# Altium schematic sheet Tiny Mic.SchDoc
size B; SheetNumber: 1; SheetTotal: 1; SPICEModelCacheUAEHSMRL: <root> / <DocumentId>UAEHSMRL</DocumentId> / </root>
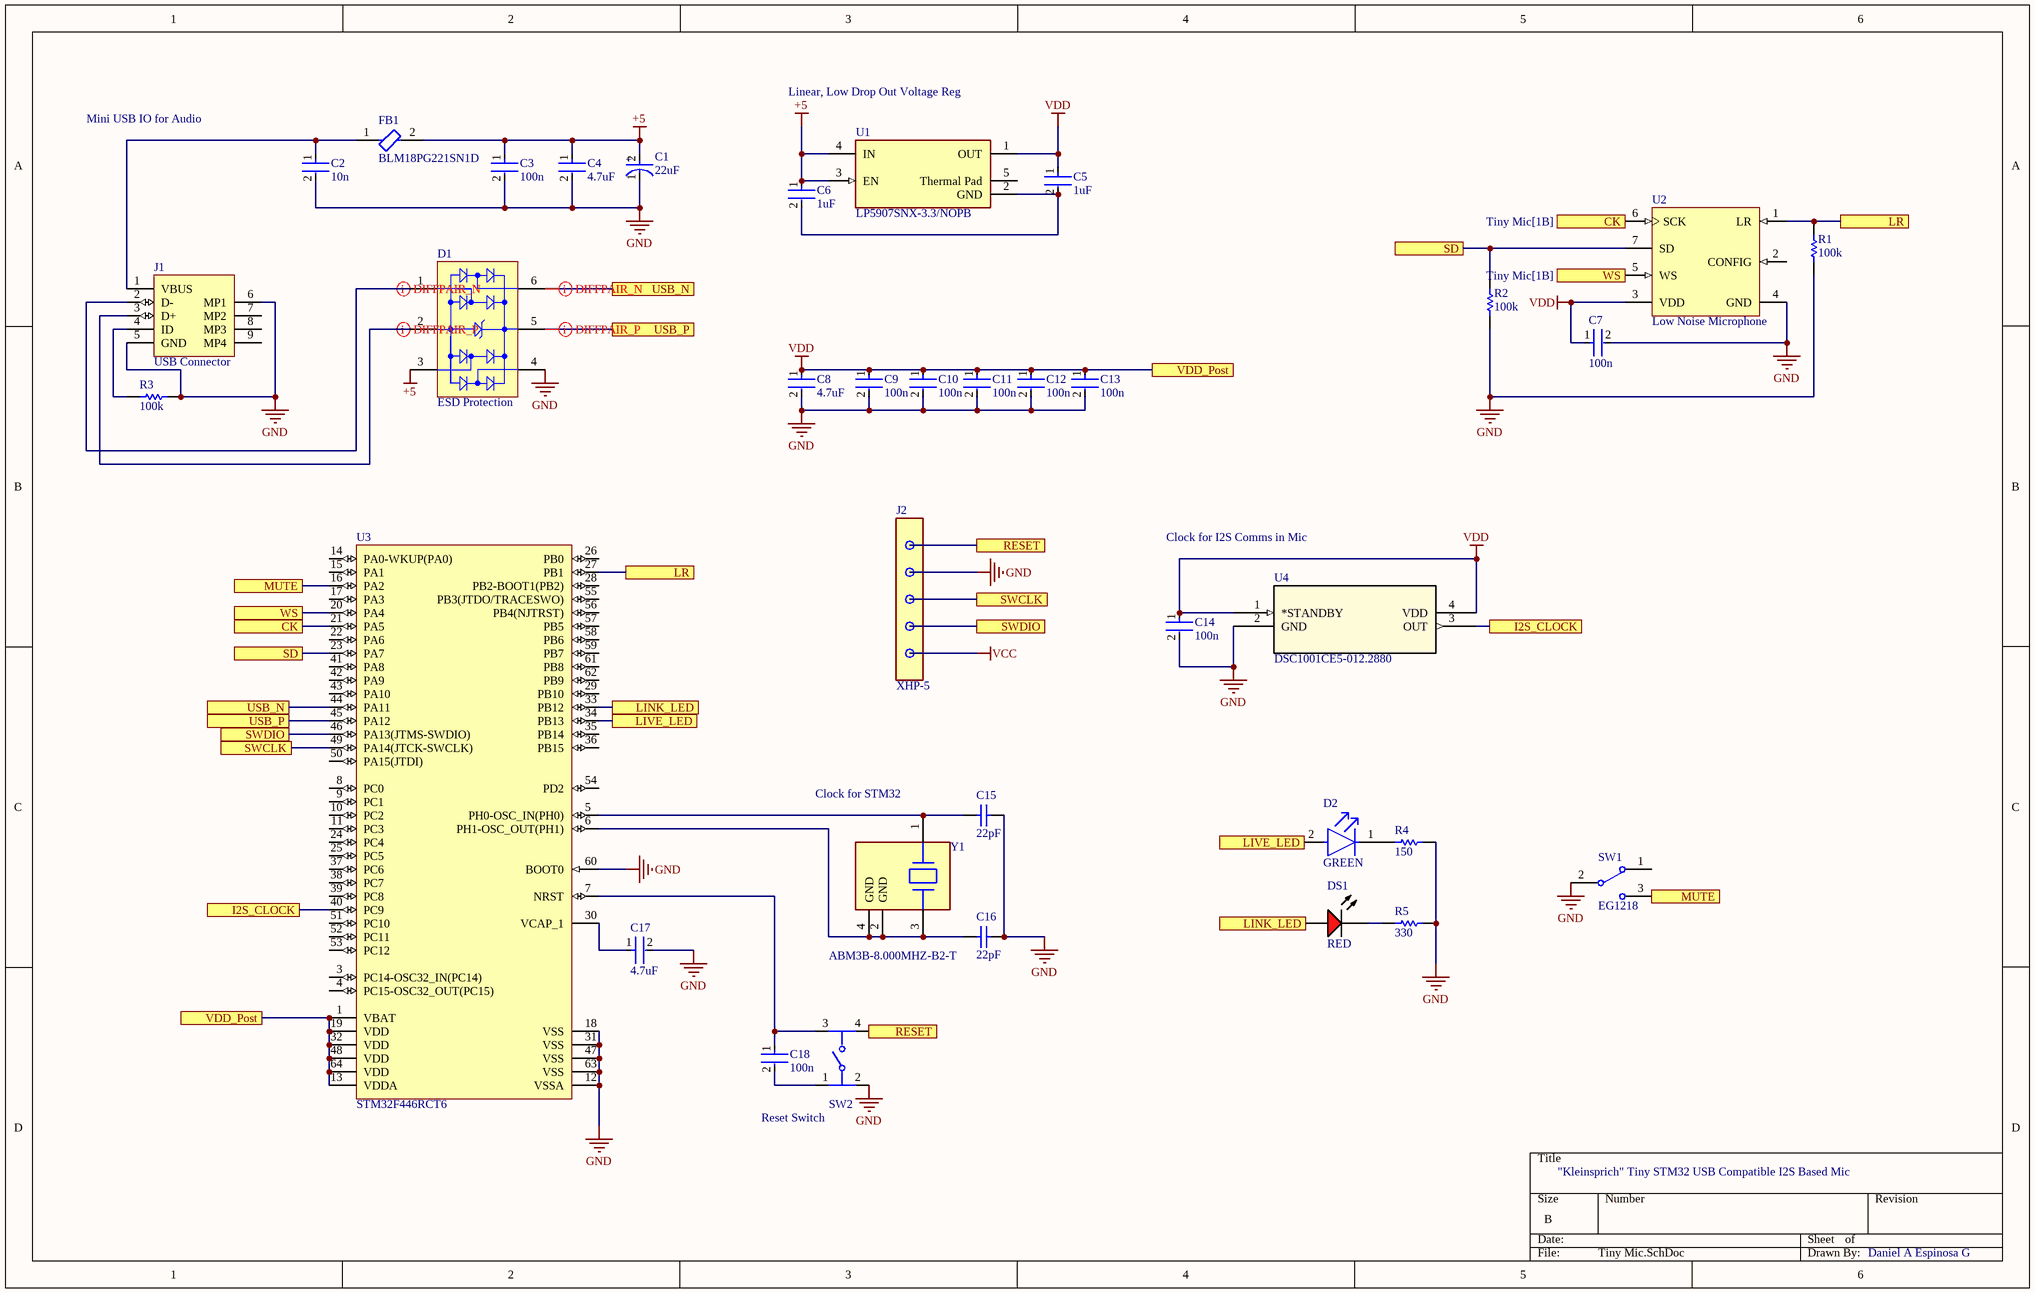
[diagram p0: Tiny Mic.SchDoc]

## Parts
C1  22uF  [FP-TAJC-MFG]
C2  10n  [FP-C0805C-DN-MFG]
C3  100n  [FP-C1206C-EB-MFG]
C4  4.7uF  [FP-C1005-050-0_15-MFG]
C5  1uF  [FP-GRM15-0_1-MFG]
C6  1uF  [FP-GRM15-0_1-MFG]
C7  100n  [FP-C1206C-EB-MFG]
C8  4.7uF  [FP-C1005-050-0_15-MFG]
C9  100n  [FP-C1206C-EB-MFG]
C10  100n  [FP-C1206C-EB-MFG]
C11  100n  [FP-C1206C-EB-MFG]
C12  100n  [FP-C1206C-EB-MFG]
C13  100n  [FP-C1206C-EB-MFG]
C14  100n  [FP-C1206C-EB-MFG]
C15  22pF  [CAPC1005X55X25NL05T10]
C16  22pF  [CAPC1005X55X25NL05T10]
C17  4.7uF  [FP-C1005-050-0_15-MFG]
C18  100n  [FP-C1206C-EB-MFG]
D1  ESD Protection  [STM-SOT23-6L_V]
D2  GREEN  [FP-LTST-C190GKT-MFG]
DS1  RED  [AVAG-HSMX-C150_V]
FB1  BLM18PG221SN1D  [FP-BLM18-0_15-t0_8-IPC_B]
J1  USB Connector  [MOLX-67503-1020_V]
J2  XHP-5  [FP-XHP-5-MFG]
R1  100k  [RESC1609X55X30ML10T20]
R2  100k  [RESC1609X55X30ML10T20]
R3  100k  [RESC1609X55X30ML10T20]
R4  150  [RESC1608X55X25ML10T15]
R5  330  [RESC1608X55X30LL15T15]
SW1  EG1218  [ESWI-EG1218_V]
SW2  (no value)  [FP-FSM2JSMAA-MFG]
U1  LP5907SNX-3.3/NOPB  [FP-DQN0004A-MFG]
U2  Low Noise Microphone  [INSE-ICS-43432_V]
U3  STM32F446RCT6  [STM-LQFP64_L]
U4  DSC1001CE5-012.2880  [CDFN4_3P2X2P5_MCH]
Y1  ABM3B-8.000MHZ-B2-T  [FP-ABM3B-MFG]

## Ports
CK (see Tiny Mic[1B]), CK (see Tiny Mic[5A]), I2S_CLOCK (see Tiny Mic[1C]), I2S_CLOCK (see Tiny Mic[5B]), LINK_LED (see Tiny Mic[2C]), LINK_LED (see Tiny Mic[4C]), LIVE_LED (see Tiny Mic[2C]), LIVE_LED (see Tiny Mic[4C]), LR (see Tiny Mic[2B]), LR (see Tiny Mic[6A]), MUTE (see Tiny Mic[1B]), MUTE (see Tiny Mic[5C]), RESET (see Tiny Mic[3B]), RESET (see Tiny Mic[3D]), SD (see Tiny Mic[1C]), SD (see Tiny Mic[5A]), SWCLK (see Tiny Mic[1C]), SWCLK (see Tiny Mic[3B]), SWDIO (see Tiny Mic[1C]), SWDIO (see Tiny Mic[3B]), USB_N (see Tiny Mic[1C]), USB_N (see Tiny Mic[2A]), USB_P (see Tiny Mic[1C]), USB_P (see Tiny Mic[2B]), VDD_Post (see Tiny Mic[1D]), VDD_Post (see Tiny Mic[4B]), WS (see Tiny Mic[1B]), WS (see Tiny Mic[5A])

## Nets
+5: C1.2(A) C3.1 C4.1 C6.1 D1.3(I/O_2) FB1.2 U1.3(EN) U1.4(IN)
GND: C1.1(C) C2.2 C3.2 C4.2 C7.2 C8.2 C9.2 C10.2 C11.2 C12.2 C13.2 C14.2 C15.2 C16.2 C17.2 D1.4(I/O_3) J1.5(GND) J1.6(MP1) R1.1 R2.1 R3.2 R4.2 R5.2 SW1.2(COM) SW2.2 U2.4(GND) U3.12(VSSA) U3.18(VSS) U3.31(VSS) U3.47(VSS) U3.60(BOOT0) U3.63(VSS) U4.2(GND)
VDD: C5.1 C7.1 C8.1 C9.1 C10.1 C11.1 C12.1 C13.1 C14.1 U1.1(OUT) U2.3(VDD) U3.1(VBAT) U3.13(VDDA) U3.19(VDD) U3.32(VDD) U3.48(VDD) U3.64(VDD) U4.1(*STANDBY) U4.4(VDD) ; port VDD_Post
CK: U2.6(SCK) U3.21(PA5) ; port CK
I2S_CLOCK: U3.40(PC9) U4.3(OUT) ; port I2S_CLOCK
LINK_LED: U3.33(PB12) ; port LINK_LED
LIVE_LED: U3.34(PB13) ; port LIVE_LED
LR: R1.2 U2.1(LR) U3.27(PB1) ; port LR
MUTE: SW1.3 U3.16(PA2) ; port MUTE
RESET: SW2.4 ; port RESET
SD: R2.2 U2.7(SD) U3.23(PA7) ; port SD
SWCLK: U3.49(PA14(JTCK-SWCLK)) ; port SWCLK
SWDIO: U3.46(PA13(JTMS-SWDIO)) ; port SWDIO
USB_N: D1.6(I/O_4) U3.44(PA11) ; port USB_N
USB_P: D1.5(VBUS) U3.45(PA12) ; port USB_P
WS: U2.5(WS) U3.20(PA4) ; port WS
NetC2_1: C2.1 FB1.1 J1.1(VBUS)
NetC5_2: C5.2 C6.2 U1.2(GND)
NetC15_1: C15.1 U3.5(PH0-OSC_IN(PH0)) Y1.1
NetC16_1: C16.1 U3.6(PH1-OSC_OUT(PH1)) Y1.2(GND) Y1.3 Y1.4(GND)
NetC17_1: C17.1 U3.30(VCAP_1)
NetC18_1: C18.1 SW2.3 U3.7(NRST)
NetC18_2: C18.2 SW2.1
NetD1_1: D1.1(I/O_1) J1.2(D-)
NetD1_2: D1.2(GND) J1.3(D+)
NetD2_1: D2.1(C) R4.1
NetDS1_2: DS1.2(K) R5.1
NetJ1_4: J1.4(ID) R3.1

Not connected (* = marked no-connect by the designer): D2 2(A); DS1 1(A); J1 7(MP2) 8(MP3) 9(MP4); SW1 1; U1 5(Thermal_Pad); U2 2(CONFIG); U3 3(PC14-OSC32_IN(PC14)) 4(PC15-OSC32_OUT(PC15)) 8(PC0) 9(PC1) 10(PC2) 11(PC3) 14(PA0-WKUP(PA0)) 15(PA1) 17(PA3) 22(PA6) 24(PC4) 25(PC5) 26(PB0) 28(PB2-BOOT1(PB2)) 29(PB10) 35(PB14) 36(PB15) 37(PC6) 38(PC7) 39(PC8) 41(PA8) 42(PA9) 43(PA10) 50(PA15(JTDI)) 51(PC10) 52(PC11) 53(PC12) 54(PD2) 55(PB3(JTDO/TRACESWO)) 56(PB4(NJTRST)) 57(PB5) 58(PB6) 59(PB7) 61(PB8) 62(PB9)

## Layout directives
differential pair: NetD1_1, NetD1_2, USB_N, USB_P

## Notes on the sheet
- Linear, Low Drop Out Voltage Reg
- Mini USB IO for Audio
- Clock for I2S Comms in Mic
- (near Y1) Clock for STM32
- (near SW2) Reset Switch
- "Kleinsprich" Tiny STM32 USB Compatible I2S Based Mic
- Daniel A Espinosa G
- (in symbol CMP-04424-000242-1) +

## Library data of the parts
C1 = CMP-04424-000242-1: 22uF 25V  ±10% 1.4Ω 2312  SMD Tantalum Capacitor  TAJC226K025RNJ; Polarity: Polar; ESR (Equivalent Series Resistance): 1.4R; Dissipation Factor: 6%; Leakage Current: 5.5uA; Min Operating Temperature: -55°C; Series: TAJ; Package Quantity: 1; Termination: SMD/SMT; Height - Seated (Max): 0.11inch; RoHS Compliant: Yes; Packaging: Tape and Reel; Dielectric Material: Tantalum; Width: 3.2mm; Number of Pins: 2; Max Operating Temperature: 125°C; Case Code (Metric): 6032; Construction: Flat; Case/Package: 2412; Lead Free: Lead Free; Case Code (Imperial): 2312; REACH SVHC: No SVHC; Voltage Rating: 25V; Length: 6mm; Height: 2.6mm; Capacitance: 22uF; Voltage: 25V; Features: General Purpose; Depth: 3.2mm; Radiation Hardening: No; Mount: Surface Mount; Voltage Rating (DC): 25V; Tolerance: 10%
C2 = CMP-2007-00259-2: CAP CER 10000PF 200V X7R 0805 C0805C103K2RACTU; Manufacturer: KEMET; Material: Ceramic; Temperature Coefficient: 30ppm/°C; Capacitance: 10,000 pF; Tolerance: 0.1; Value: 10,000 pF; Device Class L2: Capacitors; Voltage Rating: 200 V; Temperature Range High: +125°C; ComponentLink2Description: Datasheet; Height: 0.88mm; Octopart: https://octopart.com/c0805c103k2ractu-kemet-9138347; ComponentLink2URL: https://content.kemet.com/datasheets/KEM_C1003_C0G_SMD.pdf; Category: Cap; Temperature: -55°C to +125°C; Temperature Range Low: -55°C; Digikey Description: CAP CER 10000PF 200V X7R 0805; Manufacturer Part Number: C0805C103K2RACTU; Temperature Characteristic: X7R; Automotive: No; Device Class L3: Ceramic Capacitors; Mouser Description: KEMET - C0805C103K2RACTU - CAP, MLCC, X7R, 10NF, 200V, 0805; RoHS: TRUE; Device Class L1: Passive Components; Lead Free: Yes; Package: C0805C-DN; Ipc Land Pattern Name: CAPC200125X78
C3 C7 C9-C14 C18 = CMP-1037-04222-2: CAP CER 0.1UF 200V 10% X7R 1206 C1206C104K2RACTU; Manufacturer: KEMET; Automotive Grade: Grade 0; Tolerance: 0.1; Value: 0.10 μF; Material: Ceramic; Temperature Coefficient: 15%; Automotive: Yes; Temperature Characteristic: X7R; Digikey Description: CAP CER 0.1UF 200V 10% X7R 1206; ComponentLink2URL: https://content.kemet.com/datasheets/KEM_C1007_X8R_ULTRA_150C_SMD.pdf; Voltage Rating: 200 V; Manufacturer Part Number: C1206C104K2RACTU; Temperature Range High: +150°C; Device Class L1: Passive Components; Octopart: https://octopart.com/c1206c104k2ractu-kemet-9138344; Temperature: -55°C to +150°C; Height: 0.88mm; Device Class L3: Ceramic Capacitors; Lead Free: Yes; Package: C1206C-EB; Category: Cap; Temperature Range Low: -55°C; Mouser Description: Multilayer Ceramic Capacitors MLCC - SMD/SMT 200volts 0.1uF X7R 10%; Ipc Land Pattern Name: CAPC320160X78; Capacitance: 0.10 μF; RoHS: TRUE; ComponentLink2Description: Datasheet; Device Class L2: Capacitors
C4 C8 C17 = CMP-2000-05997-2: CAP CER 4.7UF 10V X5R 0402 C1005X5R1A475K050BC; Dielectric Material: Ceramic; Tolerance: 10%; Series: C; Package Quantity: 10000; Max Operating Temperature: 85°C; Case Code (Imperial): 0402; Lead Free: Lead Free; Voltage Rating (DC): 10V; Packaging: Cut Tape; Voltage Rating: 10V; Min Operating Temperature: -55°C; Dielectric: X5R; Thickness: 0.022inch; Width: 0.02inch; Case/Package: 0402; Case Code (Metric): 1005; Capacitance: 4.7uF; Length: 0.039inch; RoHS Compliant: Yes; REACH SVHC: No SVHC; Mount: Surface Mount
C5 C6 = CMP-2008-04556-2: CAP CER 1UF 10V X5R 0402 GRM155R61A105KE15D; Manufacturer: Murata; Material: Ceramic; Tolerance: 10%; Temperature Coefficient: 15%; Octopart: https://octopart.com/grm155r61a105ke15d-murata-197442; Manufacturer Part Number: GRM155R61A105KE15D; Lead Free: Yes; ComponentLink2Description: Datasheet; Temperature: -55°C to +85°C; Temperature Range High: +85°C; Height: 0.55mm; Capacitance: 1uF; Ipc Land Pattern Name: CAPC10050X50; ComponentLink2URL: https://search.murata.co.jp/Ceramy/image/img/A01X/G101/ENG/GRM155R61A105KE15-01A.pdf; Temperature Range Low: -55°C; Device Class L2: Capacitors; Voltage Rating: 10V; RoHS: TRUE; Device Class L1: Passive Components; Device Class L3: Ceramic Capacitors; Temperature Characteristic: X5R; Mouser Description: 0402 1 uF 10 V ±10% Tolerance X5R Surface Mount Multilayer Ceramic Capacitor; Automotive: No; Package: GRM15-0.1; Digikey Description: CAP CER 1UF 10V X5R 0402; Value: 1uF; Category: Cap
C15 C16 = CMP-2008-04304-1: GRM1555C1H220JZ01D; Manufacturer: Murata; Part Number: GRM1555C1H220JZ01D
D1 = CMP-2000-05378-1: Very low capacitance ESD protection, 3.5 pF, -40 to 125 degC, 6-Pin SOT23, RoHS, Tape and Reel USBLC6-2SC6; Manufacturer: STMicroelectronics; Polarity: Uni-Directional; Clamping Voltage: 17V; Rad Hardened: No; Product Height (mm): 1.3mm; Leakage Current (Max): 0.15uA; Product Length (mm): 3.05mm; Number of Elements: 1; Peak Pulse Current: 5A; Configuration: Dual; Reverse Breakdown Voltage: 6V; Working Voltage (Max): 5V; Capacitance Value: 3.5pF; Suppressor Type: DiodeArrays; Product Depth (mm): 1.75mm; Test Current (It): 1mA; Package / Case: SOT-23; Operating Temperature Max Deg. C: 125C; Package Description: 6-Pin Small Outline Transistor, Body 2.925 x 1.625 mm, Pitch 0.95 mm; Package Reference: SOT23-6L; Datasheet Version: Rev. 5, 10/2011; Operating Temperature Min Deg. C: -40C; Mounting Style: SurfaceMount; Direction Type: Uni-Directional; Mounting: SurfaceMount; Pin Count: 6; Leakage Current: 0.15uA; Packaging: TapeandReel; Operating Temperature Classification: Automotive; Clamping Voltage (Max): 17V; Manufacturer URL: http://www.st.com/; Reverse Stand-off Voltage: 5V; Datasheet URL: http://www.st.com/st-web-ui/static/active/en/resource/technical/document/datasheet/CD00050750.pdf; Working Voltage: 5V; Operating Temp Range: -40Cto125C
D2 = CMP-22017-000005-2: LED GREEN CLEAR CHIP SMD LTST-C190GKT; Dominant Wavelength: 569nm; Reverse Voltage: 5V; Lens Color: Colorless; Viewing Angle: 130°; Voltage: 2V; Forward Current: 30mA; Power Dissipation: 100mW; Luminous Intensity: 6mcd; Number of LEDs: 1; Forward Voltage: 2.1V; Wavelength: 565nm; Test Current: 10mA; Min Operating Temperature: -55°C; Lens Style: Clear; Mount: Surface Mount; Width: 0.8mm; Packaging: Tape and Reel; Lens Transparency: Clear; Case Code (Metric): 1608; Depth: 0.8mm; Case Code (Imperial): 0603; Case/Package: 0603; Number of Pins: 2; Max Operating Temperature: 85°C; Lead Free: Lead Free; Number of Elements: 1; Length: 1.6mm; Height: 0.8mm; Package Quantity: 1; Power Rating: 100mW; Radiation Hardening: No; Illumination Color: Green; Color: Green
DS1 = CMP-2000-06426-1: LED Uni-Color Red, 65 mW, 25 mA, -40 to 85 degC, 2-Pin SMD, RoHS, Tape and Reel HSMH-C150; Manufacturer: Avago; Product Height (mm): 1.1mm; Power Dissipation: 78W; Product Length (mm): 3.2mm; Forward Voltage: 2.6V; Luminous Intensity: 17mcd; DELETED: Compliant; Shape Type: Rectangular; Peak Wavelength: 660nm; Main Category: ChipLED; Dominant Wave Length: 639nm; Rad Hardened: No; Lens Type: ColorlessDiffused; Product Depth (mm): 1.6mm; Reverse Voltage: 5V; Forward Current: 25mA; Chip Material: GaAlAs; Test Current (It): 20mA; Viewing Angle: 170deg; Number of  Elements: 1; Type: Uni-Color; Package Reference: HSMX-C150; Package Description: 2-Pin Surface Mount Device, Body 3.2 x 1.6 mm; Operating Temp Range: -40Cto85C; Mounting: SurfaceMount; Emitting Color: Red; Pin Count: 2; Operating Temperature Classification: Industrial; Datasheet URL: http://media.digikey.com/pdf/Data%20Sheets/Avago%20PDFs/HSMz-Czzz.pdf; Package Type: ChipLed; Mounting Technology: SurfaceMount; High Brightness: No; Lens Dimensions: 2x1.6x0.6mm; Manufacturer URL: http://www.avagotech.com/; Lum Intensity: 17mcd; Datasheet Version: 03/2012; Packaging: TapeandReel
FB1 = CMP-0686-00569-3: Chip Ferrite Bead, 0603, 220Ω @ 100MHz, 0.1Ω, 25%, 1.4A; Manufacturer Series: BLM18P; Number of Functions: 1; Shielding: Unshielded; ESR (Equivalent Series Resistance): 220R; Material: Steel; DC Resistance-Max: 100mR; Lead Free: Lead Free; Current Rating: 1.4A; Test Frequency: 100MHz; Package Quantity: 1; REACH SVHC: No SVHC; Series: BLM18P; Number of Circuits: 1; Height: 0.8mm; Number of Pins: 2; Termination: SMD/SMT; Width: 0.8mm; Max DC Current: 1.4A; Depth: 0.8mm; RoHS Compliant: Yes; Case Code (Imperial): 0603; Number of Lines: 1; Length: 1.6mm; Max Current Rating: 1.4A; Case/Package: 0603; DC Current: 1.4A; Max Operating Temperature: 125°C; Weight: 7.1E-05oz; Tolerance: 25%; Impedance: 220R; Radiation Hardening: No; Packaging: Tape and Reel; DC Resistance (DCR): 100mR; Resistance: 100mR; Min Operating Temperature: -55°C; Core Material: Ferrite; Case Code (Metric): 1608
J1 = CMP-0411-00002-1: USB, MINI, SMD, RA KME04-USBMU03A01 67503-1020; Manufacturer: Molex; ComponentLink1URL: http://www.molex.com/; PartNumber: 67503-1020; Mounting Technology: Surface Mount; ComponentLink1Description: Manufacturer URL; Terminal Pitch: 0.8 mm; DatasheetVersion: Rev F, 06/2009; ComponentLink2Description: Datasheet; PackageDescription: Mini USB Connector, SMT, Righer Angle; ComponentLink2URL: http://www.molex.com/pdm_docs/sd/675031020_sd.pdf; PackageReference: 67503-1020
J2 = CMP-17439-000071-1: CONN HOUSING 2.5MM 5POS; Voltage Rating (AC): 250V; Max Current Rating: 3A; Gender: Receptacle; Number of Contacts: 5; Wire Gauge (Max): 30AWG; Wire/Cable Gauge: 22AWG; Insulation Resistance: 1GR; Contact Resistance: 10mR; Pitch: 2.5mm; Number of Rows: 1; Contact Type: Female Socket; Max Voltage Rating (AC): 250V; Max Operating Temperature: 85°C; Lead Free: Lead Free; Weight: 0.0625lb; Series: XH; Number of Positions: 5; Mount: Free Hanging; Connector Type: Receptacle; Housing Color: White; REACH SVHC: No SVHC; Termination: Crimp; Lead Pitch: 2.5mm; Wire Gauge (Min): 22AWG; Width: 5.7mm; Color: Natural; Packaging: Bag; Orientation: Straight; Depth: 7.75mm; Max Voltage Rating (DC): 250V; Length: 14.8mm; Housing Material: Polyamide; Current Rating: 3A; Contact Material: Bronze; Height: 0.25inch; Min Operating Temperature: -25°C
R1-R3 = CMP-2000-03686-1: TNPW0603100KBEEN; Manufacturer: Vishay Dale; Part Number: TNPW0603100KBEEN
R4 = CMP-1659-00057-1: Chip Resistor, 150 Ohm, +/- 1%, 0.1 W, -55 to 155 degC, 0603 (1608 Metric), RoHS, Tape and Reel RC0603FR-07150RL; Viewing Angle: 20 degrees; Luminous Intensity: 200 mcd; Case\Package: Radial; Lens Style: Clear; Nominal Vf: 2.2 V; Illumination Colour: Green; PackageReference: 0603; PackageDescription: 2-Pin Surface Mount Device, Body 1.6 x 0.8 mm; Package Quantity: 1000; Packaging: Bulk; DatasheetVersion: Rev. 4, 02/2016; ComponentLink2URL: http://www.yageo.com/documents/recent/PYu-RC_Group_51_RoHS_L_04.pdf; ComponentLink1Description: Manufacturer URL; Height: 8.6 mm; ComponentLink2Description: Datasheet; Mount: Through Hole; Colour: Green; RoHSCompliant: true; ComponentLink1URL: http://www.yageo.com/; Forward Voltage: 2.2 V
R5 = CMP-2000-00435-2: Chip Resistor, 330 Ohm, +/- 1%, 0.1 W, -55 to 155 degC, 0603 (1608 Metric), RoHS, Tape and Reel ERJ-3EKF3300V; Gender: Male; Mating Cycles: 10000; Current Rating: 500 mA; Voltage Rating: 10 V; REACH SVHC: No SVHC; PackageDescription: 2-Pin Surface Mount Device, Body 1.6 x 0.85 mm; Contact Finish: Gold; Pins: 8; ComponentLink1Description: Manufacturer URL; Packaging: Tape and Reel; Max Operating Temperature: 85 degC; Contact Material: Copper; Height: 1.45 mm; Width: 1.45 mm; DatasheetVersion: Apr-15; Package Quantity: 1500; Contact Plating: Gold; PackageReference: 0603; Mount: Surface Mount; Lead Pitch: 1.1 mm; Min Operating Temperature: -25 degC; ComponentLink1URL: http://www.panasonic.com/; ComponentLink2URL: http://industrial.panasonic.com/cdbs/www-data/pdf/RDA0000/AOA0000C86.pdf; Length: 13.7 mm; ComponentLink2Description: Datasheet; RoHSCompliant: true
SW1 = CMP-1696-00002-1: Slide Switch, 500 V, -20 to 70 degC, 3-Pin THD, RoHS; Case\Package: SOT-23-5; Output Current: 150 mA; Nominal Output Voltage: 3.3 V; Max Power Dissipation: 250 mW; Min Input Voltage: 4.3 V; Outputs: 1; Max Input Voltage: 8 V; Dropout Voltage: 300 mV; PackageDescription: 3-Pin Through Hole Device, Body 11.6 x 4 mm, Pitch 2.5 mm; ComponentLink1URL: http://www.e-switch.ch/en/; RoHSCompliant: true; Length: 3 mm; ComponentLink1Description: Manufacturer URL; Power Rating: 250 mW; Mount: Surface Mount; Max Operating Temperature: 85 degC; REACH SVHC: No SVHC; Radiation Hardening: No; Height: 1.3 mm; Pins: 5; Max Ouput Current: 150 mA; Output Voltage: 3.3 V; Width: 1.8 mm; Package Quantity: 3000; ComponentLink2URL: https://www.e-switch.com/system/asset/product_line/data_sheet/119/EG.pdf; Min Operating Temperature: -40 degC; ComponentLink2Description: Datasheet; DatasheetVersion: Oct-15; PackageReference: EG1218; Packaging: Tape and Reel
SW2 = CMP-03402-000003-1: SWITCH TACTILE SPST-NO 0.05A 24V FSM2JSMAA; Manufacturer: TE Connectivity; Standoff Height: 0.05mm; Contact Current Rating: 50mA; Electromechanical Life: 100000Cycles; Operating Force: 260gf; Contact Resistance: 100mΩ; Package: 0; Temperature Range High: +85°C; Temperature: -35°C to +85°C; Category: Switch; Manufacturer Part Number: FSM2JSMAA; RoHS: TRUE; Mouser Description: Tactile Switches TACTILE 260G FORCE S; Device Class L1: Electromechanical; Mount: Surface Mount; Height: 4.59mm; ComponentLink2URL: https://www.te.com/commerce/DocumentDelivery/DDEController?Action=showdoc&DocId=Customer+Drawing%7F2-1437565-7%7FV%7Fpdf%7FEnglish%7FENG_CD_2-1437565-7_V.pdf%7F2-1437565-8; Temperature Range Low: -35°C; Voltage Rating Dc: 24V; Lead Free: Yes; Automotive: No; Description: SWITCH TACTILE SPST-NO 0.05A 24V; Throw Configuration: SPST-NO; Octopart: https://octopart.com/fsm2jsmaa-te+connectivity-41720620; Device Class L2: Switches; Device Class L3: Pushbutton Switches; ComponentLink2Description: Datasheet; Digikey Description: SWITCH TACTILE SPST-NO 0.05A 24V
U1 = CMP-04917-000059-2: None; Number of Regulators: 1; Min Input Voltage: 2.2V; Quiescent Current: 250uA; Max Input Voltage: 5.5V; Power Supply Rejection Ratio (PSRR): 82dB; Max Output Current: 250mA; Accuracy: 2%; Polarity: Positive; Output Voltage: 3.3V; Output Type: Fixed; Dropout Voltage: 250mV; Number of Pins: 4; Packaging: Tape and Reel; RoHS Compliant: Yes; REACH SVHC: No SVHC; Output Voltage Accuracy: 2%; Mount: Surface Mount; Output Current: 250mA; Max Operating Temperature: 125°C; Contact Plating: Gold; Radiation Hardening: No; Lead Free: Lead Free; Min Operating Temperature: -40°C; Number of Outputs: 1; Tolerance: 2%; Nominal Output Voltage: 3.3V
U2 = CMP-2000-06439-1: Low Noise Microphone with I2S Digital Output, 1 mA, -40 to 85 degC, 7-Pin SMD, RoHS, Tape and Reel ICS-43432; Manufacturer: InvenSense; Sensitivity: -26dB±1dB@94dBSPL; Direction: Omnidirectional; Frequency Range: 50Hz~20kHz; Voltage Range: 1.62~3.63V; Shape: Rectangular; S/N Ratio: 65dB; Output Type: Digital,I²S; Seal Rating: None; Port Location: Bottom; Current - Supply: 1.5mA; Termination: SolderPads; Datasheet URL: https://www.invensense.com/wp-content/uploads/2015/02/ICS-43432-data-sheet-v1.3.pdf; Series: -; Size / Dimension: 4.00mmLx3.00mmW; Family: Microphones; Category: AudioProducts; Voltage - Rated: -; Impedance: -; Type: MEMS(Silicon); Packaging: Tape&amp;Reel(TR); Mounting Technology: SurfaceMount; Height (Max): 1.10mm; Package Reference: ICS-43432; Package Description: 7-Pin Surface Mount Device, Body 4 x 3 mm, Pitch 0.65 mm, Height 1.1 mm; Datasheet Version: Rev. 1.3, 04/2016; Manufacturer URL: http://www.invensense.com/
U3 = CMP-0243-00216-1: ARM Cortex-M4 32-bit MCU+FPU, 256 KB Flash, 128 KB Internal RAM, 50 I/Os, 64-Pin LQFP, -40 to 85 degC, Tray; Operating Frequency(F) (Processor speed) (MHz): 180; Internal RAM Size (kB): 128; I/Os (High Current): 50; FLASH Size (Prog) (kB): 256; D/A Converter: 2; Supply Voltage(Vcc) min (V): 1.7; Mounting Technology: Surface Mount; DatasheetVersion: Rev. 6; ComponentLink1URL: http://www.st.com/; Package Description: LQFP64; ComponentLink1Description: Manufacturer URL; Packing: Tray; ComponentLink2Description: Datasheet; Core: ARM Cortex-M4; Package Reference: 64-Pin Low-profile Quad Flat Package, Body 10 x 10 mm, Pitch 0.5 mm; ComponentLink2URL: http://www.st.com/st-web-ui/static/active/en/resource/technical/document/datasheet/DM00141306.pdf
U4 = DSC1001CE5-012.2880: 12.288 MHz XO (Standard) CMOS Oscillator 1.8V ~ 3.3V Standby (Power Down) 4-SMD, No Lead DSC1001CE5-012.2880; Mfr_Name: Microchip; RefDes: RefDes; Type: Type
Y1 = CMP-1688-00002-2: Crystal 8MHz ±20ppm 18pF SMD-4 5mm x 3.2mm; ESR (Equivalent Series Resistance): 200R; Frequency Stability: 50ppm; Operating Frequency: 8 MHz; Mount: Surface Mount; Number of Pins: 4; Packaging: Tape and Reel; Width: 0.126inch; Case/Package: CSMD; Lead Free: Lead Free; Depth: 3.2mm; Load Capacitance: 18pF; Min Operating Temperature: -20°C; Series: ABM3B; Package Quantity: 1000; Resistor Type: Ceramic; Height: 0.043inch; Max Operating Temperature: 70°C; Frequency Tolerance: 20ppm; Series Resistance: 200R; Tolerance: 20ppm; Termination: SMD/SMT; Length: 5mm; Frequency: 8MHz